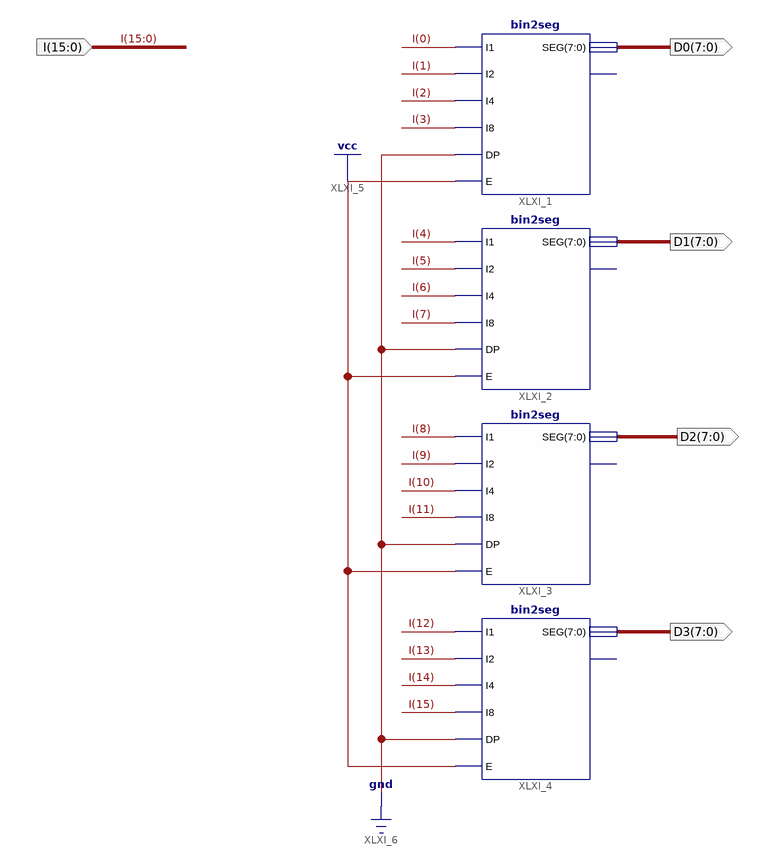
[diagram p0: schematic sheet 1]
// Xilinx ISE schematic word2seg.sch (spartan3e) as structural Verilog: 4 symbols, 5 ports
module word2seg (
  input  [15:0] I,
  output [7:0] D0,
  output [7:0] D1,
  output [7:0] D2,
  output [7:0] D3
);

  bin2seg XLXI_1 (.DP(1'b0), .E(1'b1), .I1(I[0]), .I2(I[1]), .I4(I[2]), .I8(I[3]), .SEG(D0));  // open: NZ
  bin2seg XLXI_2 (.DP(1'b0), .E(1'b1), .I1(I[4]), .I2(I[5]), .I4(I[6]), .I8(I[7]), .SEG(D1));  // open: NZ
  bin2seg XLXI_3 (.DP(1'b0), .E(1'b1), .I1(I[8]), .I2(I[9]), .I4(I[10]), .I8(I[11]), .SEG(D2));  // open: NZ
  bin2seg XLXI_4 (.DP(1'b0), .E(1'b1), .I1(I[12]), .I2(I[13]), .I4(I[14]), .I8(I[15]), .SEG(D3));  // open: NZ
endmodule
